# EAGLE design dualevse (EAGLE 9.5.0)
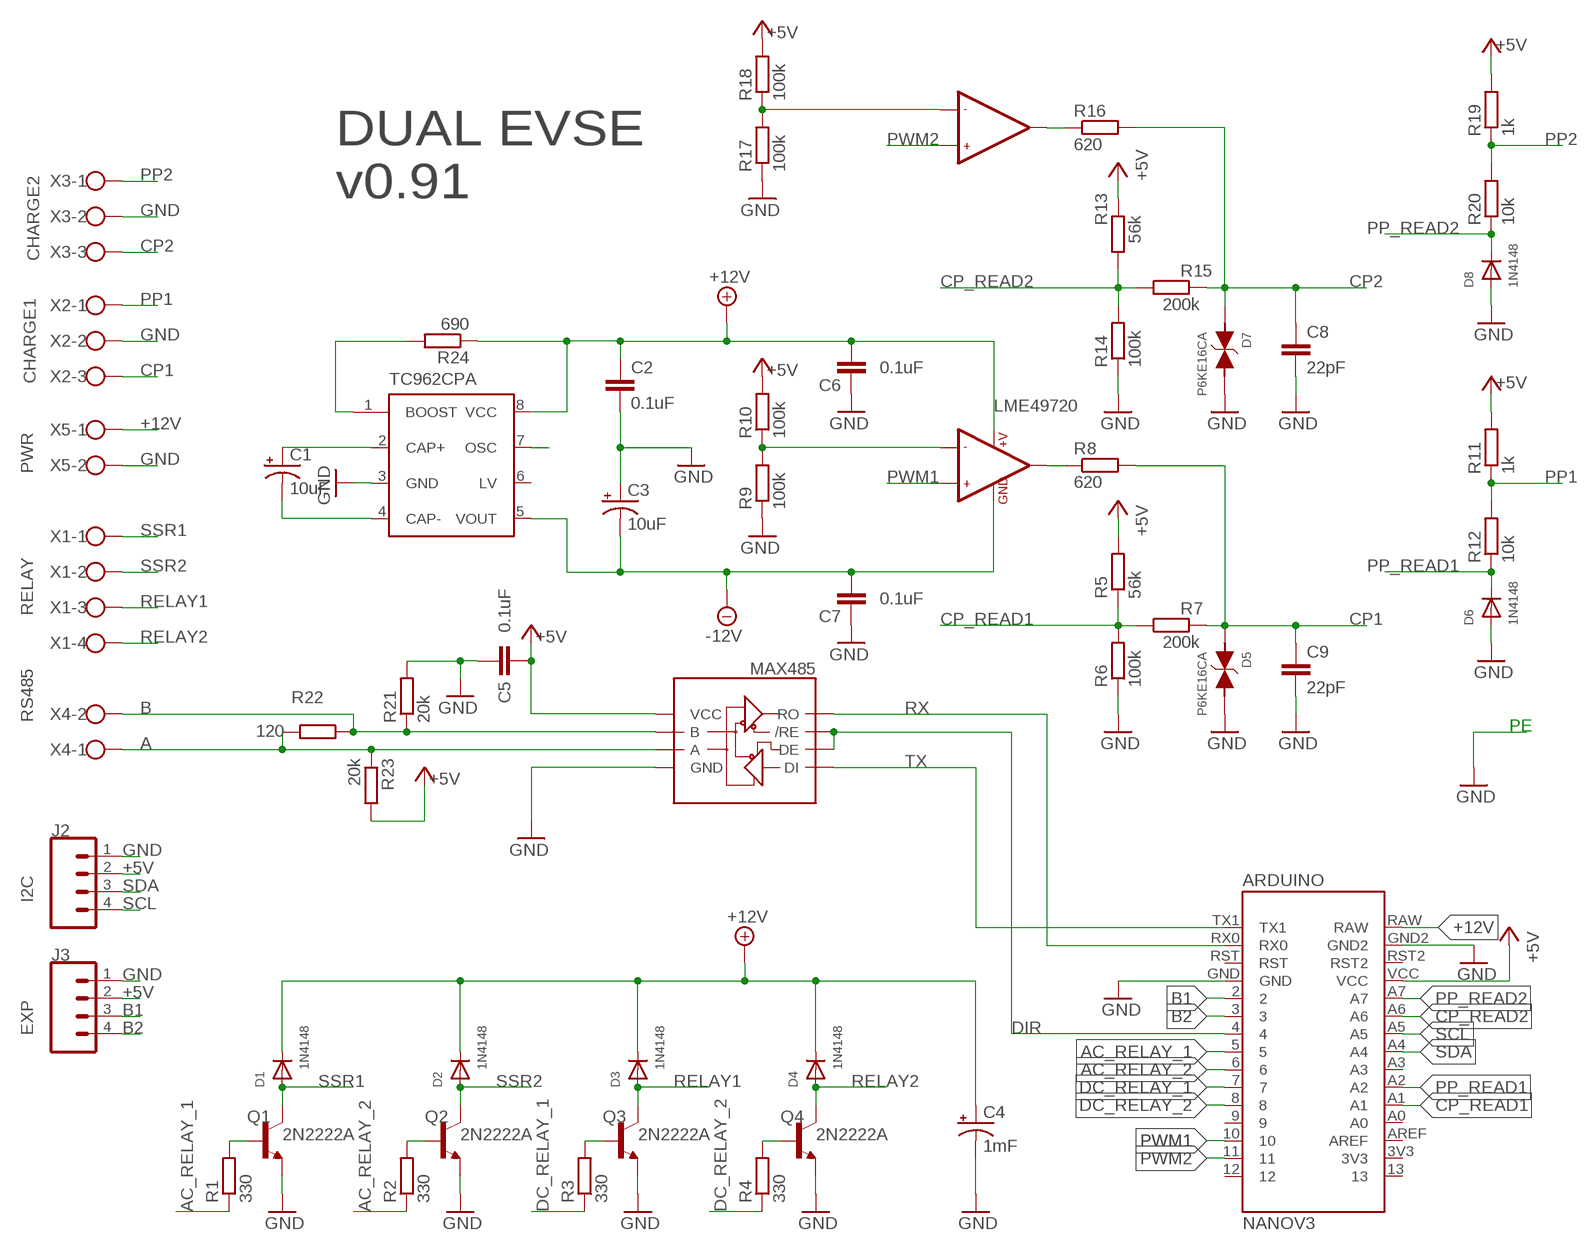
[diagram p0: schematic, sheet 1]

## Parts
ARDUINO  NANOV3  [NANOV3]
C1  10uF  10UF-POLAR-RADIAL-2.5MM-25V-20%  [CPOL-RADIAL-2.5MM-5MM]
C2  0.1uF  0.1UF-KIT-EZ-50V-20%  [CAP-PTH-SMALL-KIT]
C3  10uF  10UF-POLAR-RADIAL-2.5MM-25V-20%  [CPOL-RADIAL-2.5MM-5MM]
C4  1mF  1000UF-RADIAL-5MM-25V-20%  [CPOL-RADIAL-5MM-10MM]
C5  0.1uF  0.1UF-KIT-EZ-50V-20%  [CAP-PTH-SMALL-KIT]
C6  0.1uF  0.1UF-KIT-EZ-50V-20%  [CAP-PTH-SMALL-KIT]
C7  0.1uF  0.1UF-KIT-EZ-50V-20%  [CAP-PTH-SMALL-KIT]
C8  22pF  22PF-PTH-2.54MM-200V-5%  [CAP-PTH-2.54]
C9  22pF  22PF-PTH-2.54MM-200V-5%  [CAP-PTH-2.54]
D1  1N4148  DIODEDO-1N4148  [DO-1N4148]
D2  1N4148  DIODEDO-1N4148  [DO-1N4148]
D3  1N4148  DIODEDO-1N4148  [DO-1N4148]
D4  1N4148  DIODEDO-1N4148  [DO-1N4148]
D5  P6KE16CA  TVSDO2  [C4111-15]
D6  1N4148  DIODEDO-1N4148  [DO-1N4148]
D7  P6KE16CA  TVSDO2  [C4111-15]
D8  1N4148  DIODEDO-1N4148  [DO-1N4148]
J2  I2C  CONN_04POLAR  [MOLEX-1X4]
J3  EXP  CONN_04POLAR  [MOLEX-1X4]
LME49720  LME49720  LF353DIL08  [TEXAS_DIL08]
MAX485  SPARKFUN-IC-COMMS_RS485  [TEXAS_DIL08]
Q1  2N2222A  [TO18]
Q2  2N2222A  [TO18]
Q3  2N2222A  [TO18]
Q4  2N2222A  [TO18]
R1  330  R-EU_0207/10  [0207/10]
R2  330  R-EU_0207/10  [0207/10]
R3  330  R-EU_0207/10  [0207/10]
R4  330  R-EU_0207/10  [0207/10]
R5  56k  R-EU_0207/10  [0207/10]
R6  100k  R-EU_0207/10  [0207/10]
R7  200k  R-EU_0207/10  [0207/10]
R8  620  R-EU_0207/10  [0207/10]
R9  100k  R-EU_0207/10  [0207/10]
R10  100k  R-EU_0207/10  [0207/10]
R11  1k  R-EU_0207/10  [0207/10]
R12  10k  R-EU_0207/10  [0207/10]
R13  56k  R-EU_0207/10  [0207/10]
R14  100k  R-EU_0207/10  [0207/10]
R15  200k  R-EU_0207/10  [0207/10]
R16  620  R-EU_0207/10  [0207/10]
R17  100k  R-EU_0207/10  [0207/10]
R18  100k  R-EU_0207/10  [0207/10]
R19  1k  R-EU_0207/10  [0207/10]
R20  10k  R-EU_0207/10  [0207/10]
R21  20k  R-EU_0207/10  [0207/10]
R22  120  R-EU_0207/10  [0207/10]
R23  20k  R-EU_0207/10  [0207/10]
R24  690  R-EU_0207/10  [0207/10]
TC962CPA  TEXAS_TL7660  [TEXAS_DIL08]
X1  RELAY  W237-4  [W237-4]
X2  CHARGE1  W237-103  [W237-103]
X3  CHARGE2  W237-103  [W237-103]
X4  RS485  W237-102  [W237-102]
X5  PWR  W237-102  [W237-102]

## Nets
+5V [PWR]: ARDUINO.VCC C5.2 J2.2 J3.2 MAX485.8(VCC) R5.2 R10.2 R11.2 R13.2 R18.2 R19.2 R23.2
+12V [PWR]: ARDUINO.RAW C2.1 C4.+ C6.1 D1.C D2.C D3.C D4.C LME49720.8(+V) R24.1 TC962CPA.8(VCC) X5.1
-12V [PWR]: C3.2(-) C7.2 LME49720.4(GND) TC962CPA.5(VOUT)
A: MAX485.6(A) R22.1 R23.1 X4.1
AC_RELAY_1: ARDUINO.5 R1.1
AC_RELAY_2: ARDUINO.6 R2.1
B: MAX485.7(B) R21.1 R22.2 X4.2
B1: ARDUINO.2 J3.3
B2: ARDUINO.3 J3.4
CP1 [PWR]: C9.1 D5.A R7.2 R8.2 X2.3
CP2 [PWR]: C8.1 D7.A R15.2 R16.2 X3.3
CP_READ1: ARDUINO.A1 R5.1 R6.2 R7.1
CP_READ2: ARDUINO.A6 R13.1 R14.2 R15.1
DC_RELAY_1: ARDUINO.7 R3.1
DC_RELAY_2: ARDUINO.8 R4.1
DIR: ARDUINO.4 MAX485.2(/RE) MAX485.3(DE)
GND [GND]: ARDUINO.GND ARDUINO.GND2 C2.2 C3.1(+) C4.- C5.1 C6.2 C7.1 C8.2 C9.2 D5.C D6.A D7.C D8.A J2.1 J3.1 MAX485.5(GND) Q1.1(E) Q2.1(E) Q3.1(E) Q4.1(E) R6.1 R9.1 R14.1 R17.1 R21.2 TC962CPA.3(GND) X2.2 X3.2 X5.2
N$1: LME49720.6(-IN2) R17.2 R18.1
N$2: Q3.2(B) R3.2
N$3: Q4.2(B) R4.2
N$4: LME49720.7(OUT2) R16.1
N$5: Q1.2(B) R1.2
N$6: Q2.2(B) R2.2
N$7 [PWR]: R24.2 TC962CPA.1(BOOST)
N$10: LME49720.2(-IN1) R9.2 R10.1
N$11: LME49720.1(OUT1) R8.1
N$36: C1.1(+) TC962CPA.2(CAP+)
N$38: C1.2(-) TC962CPA.4(CAP-)
NC: TC962CPA.7(OSC)
PP1 [PWR]: R11.1 R12.2 X2.1
PP2 [PWR]: R19.1 R20.2 X3.1
PP_READ1: ARDUINO.A2 D6.C R12.1
PP_READ2: ARDUINO.A7 D8.C R20.1
PWM1: ARDUINO.10 LME49720.3(+IN1)
PWM2: ARDUINO.11 LME49720.5(+IN2)
RELAY1 [PWR]: D3.A Q3.3(C) X1.3
RELAY2 [PWR]: D4.A Q4.3(C) X1.4
RX: ARDUINO.RX0 MAX485.1(RO)
SCL: ARDUINO.A5 J2.4
SDA: ARDUINO.A4 J2.3
SSR1 [PWR]: D1.A Q1.3(C) X1.1
SSR2 [PWR]: D2.A Q2.3(C) X1.2
TX: ARDUINO.TX1 MAX485.4(DI)
Unconnected: ARDUINO.3V3 ARDUINO.9 ARDUINO.12 ARDUINO.13 ARDUINO.A0 ARDUINO.A3 ARDUINO.AREF ARDUINO.RST ARDUINO.RST2 TC962CPA.6(LV)

## Notes on the sheet
- DUAL EVSE
  v0.91
- PE

## Library data of the parts
ARDUINO = Arduino Nano by Jazz:NANOV3
C1 C3 = SparkFun-Capacitors:10UF-POLAR: 10.0µF polarized capacitors A capacitor is a passive two-terminal electrical component used to store electrical energy temporarily in an electric field.; PROD_ID: CAP-08440
C2 C5-C7 = SparkFun-Capacitors:0.1UF: 0.1µF ceramic capacitors A capacitor is a passive two-terminal electrical component used to store electrical energy temporarily in an electric field.; PROD_ID: CAP-08370
C4 = SparkFun-Capacitors:1000UF: 1,000µF/1mF ceramic capacitors A capacitor is a passive two-terminal electrical component used to store electrical energy temporarily in an electric field. CAP-08070; PROD_ID: CAP-09538
C8 C9 = SparkFun-Capacitors:22PF: 22pF ceramic capacitors A capacitor is a passive two-terminal electrical component used to store electrical energy temporarily in an electric field.; PROD_ID: CAP-09128
D1-D4 D6 D8 = adafruit:DIODE: Diode SMADIODE - SMA Surface Mount Package 20V 1A Schottky Diode Digikey: 641-1014-6-ND DO-1N4148 - Through Hole Small Current Diode SOD-123 20V 1 A (.5mV Vf) Schottky Diode - Digikey: MBRX120TPMSCT-ND SOD-323 10V 570mA (.38mV Vf, 3ns) Schottky Diode - Digikey: ZLLS410CT-ND SOD-523 30V 30mA Schottky Diode (RB751S-40TE61) - Digikey: RB751S-40TE61CT-ND SOT23-R/W - SOT23 Package (R = Solder Paste/Reflow Ovens, W = Hand-Soldering) BAT54Film 40V 300mA - Digikey: 497-7162-1-ND
D5 D7 = evse_nano:TVS: WE-TVSP Power TVS Diode <http://katalog.we-online.de/media/images/v2/WE-TVSP_600W-3000W_D0214AA_4C.jpg> Details see: http://katalog.we-online.de/en/pbs/WE-TVSP/824500101 2015 (C) Würth Elektronik
J2 J3 = SparkFun-Connectors:CONN_04: Multi connection point. Often used as Generic Header-pin footprint for 0.1 inch spaced/style header connections On any of the 0.1 inch spaced packages, you can populate with these: Break Away Headers - Straight <https://www.sparkfun.com/products/116> (PRT-00116) Break Away Male Headers - Right Angle <https://www.sparkfun.com/products/553> (PRT-00553) Female Headers <https://www.sparkfun.com/products/115> (PRT-00115) Break Away Headers - Machine Pin <https://www.sparkfun.com/products/117> (PRT-00117) Break Away Female Headers - Swiss Machine Pin <https://www.sparkfun.com/products/743> (PRT-00743) For SCREWTERMINALS and SPRING TERMINALS visit here: Screw Terimnals on SparkFun.com <https://www.sparkfun.com/search/results?term=Screw+Terminals> (5mm/3.5mm/2.54mm spacing) This device is also useful as a general connection point to wire up your design to another part of your project. Our various solder wires solder well into these plated through hole pads. Hook-Up Wire - Assortment (Stranded, 22 AWG) <https://www.sparkfun.com/products/11375> (PRT-11375) Hook-Up Wire - Assortment (Solid Core, 22 AWG) <https://www.sparkfun.com/products/11367> (PRT-11367) View the entire wire category on our website here <https://www.sparkfun.com/categories/141> Special notes: Molex polarized connector foot print use with SKU : PRT-08231 with associated crimp pins and housings. 1MM SMD Version SKU: PRT-10208; PROD_ID: CONN-08186; SF_ID: PRT-08231
LME49720 = evse_nano:LF353
MAX485 = evse_nano:SPARKFUN-IC-COMMS_RS485: RS-485 Transceiver SP3485 Series 8 Pin NSOIC 3.3 V Low Power Half Duplex RS-485 Transceiver MAX3485 compatible Datasheet <http://www.sparkfun.com/datasheets/Components/General/sp3485CN-LTR.pdf> SparkFun Products SparkFun Transceiver Breakout - RS-485 <https://www.sparkfun.com/products/10124> (BOB-10124) SparkFun USB to RS-485 Converter <https://www.sparkfun.com/products/9822> (BOB-09822)
Q1-Q4 = transistor-npn:2N2222*: NPN Transistor
R1-R24 = resistor:R-EU_: RESISTOR, European symbol
TC962CPA = evse_nano:TEXAS_TL7660: CMOS VOLTAGE CONVERTER Source: http://focus.ti.com/lit/ds/scas794/scas794.pdf
X1 = con-wago-500:W237-4: WAGO SCREW CLAMP; OC_FARNELL: unknown; OC_NEWARK: unknown
X2 X3 = con-wago-500:W237-103: WAGO SCREW CLAMP; MPN: 237-103; OC_FARNELL: unknown; OC_NEWARK: 18M7116
X4 X5 = con-wago-500:W237-102: WAGO SCREW CLAMP; MPN: 237-102; OC_FARNELL: unknown; OC_NEWARK: 70K9898

## Net classes
0 default: width 0.508 mm, drill 0.254 mm, clearance 0.254 mm
1 GND: width 1.016 mm, drill 0.508 mm, clearance 0.254 mm
4 PWR: width 1.016 mm, drill 0.508 mm, clearance 0.254 mm to class 2, clearance 0.254 mm

## Board
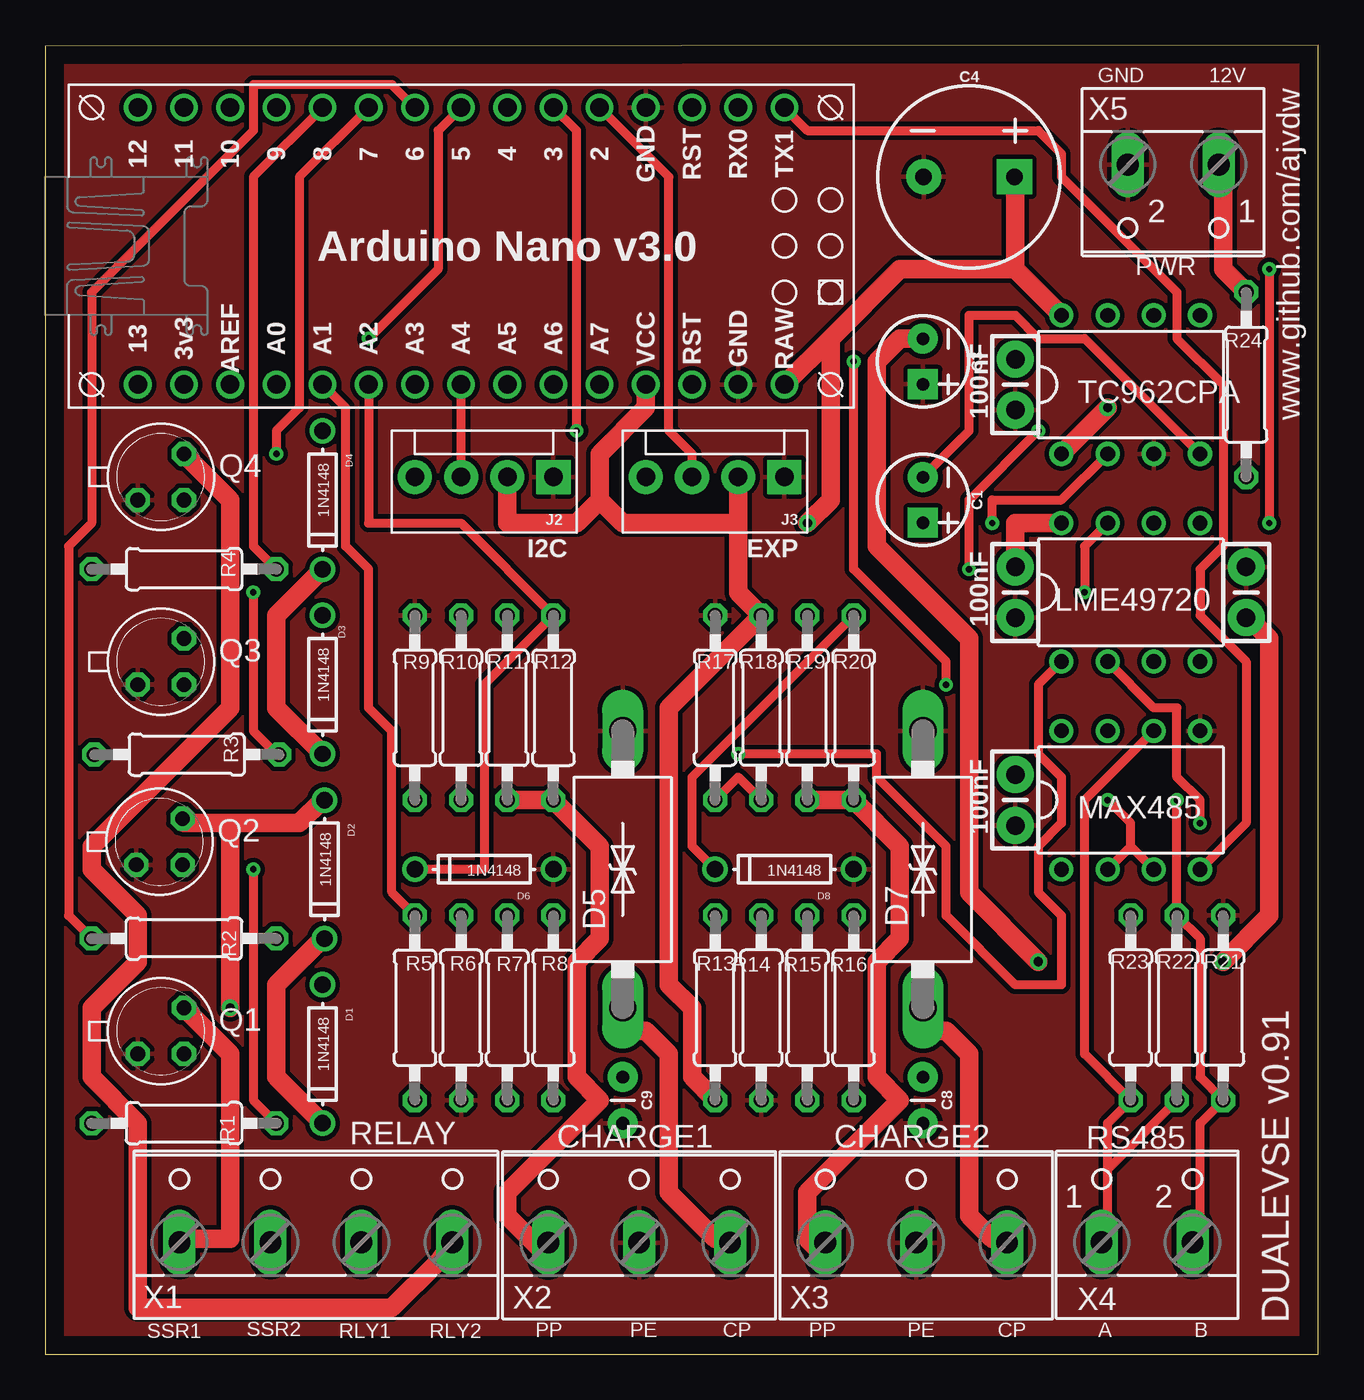
[diagram p1: board, top side]
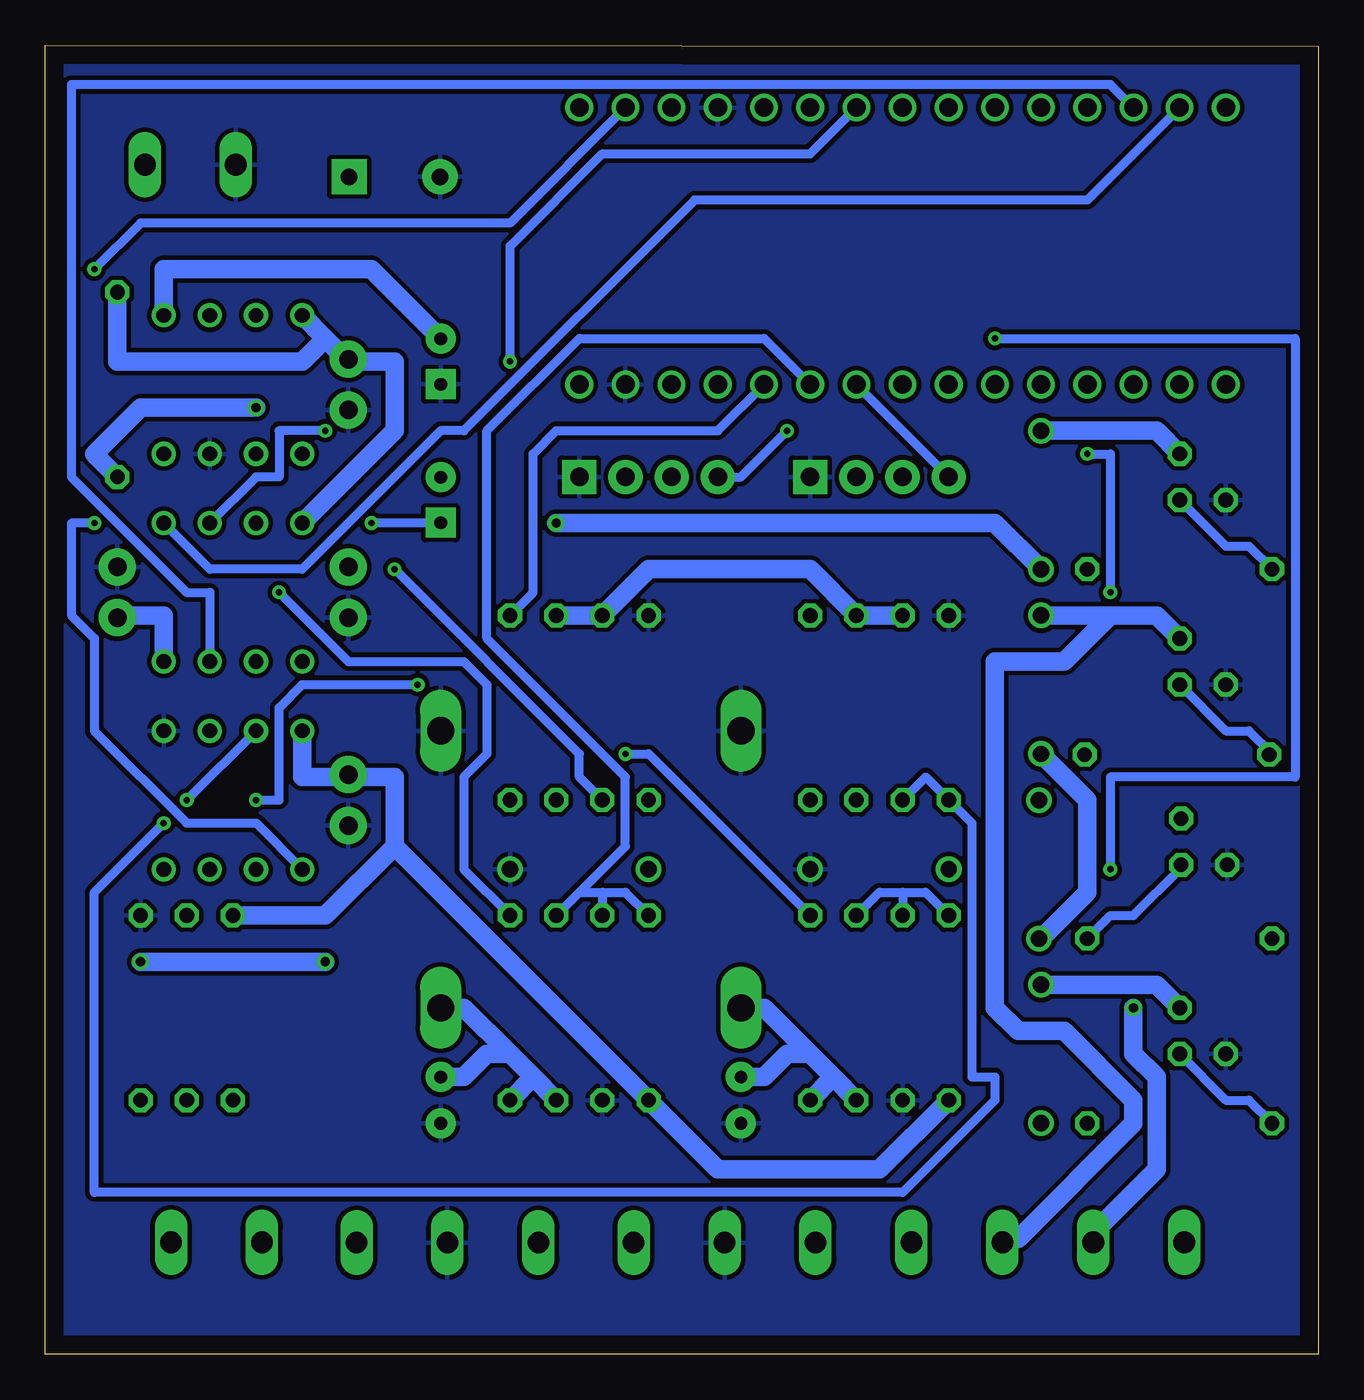
[diagram p2: board, bottom side, seen from below]

Size 70 x 72 mm. Coordinates in mm from the lower left corner, seen from the top.
Outline: 0,0 70,0 70,72 0,71.97 0,0
Copper layers (1*16): Top 0.035mm / dielectric 1.5mm / Bottom 0.035mm
Design rules "default": minimum track width 6mil, minimum drill 0.35mm, track to track 6mil, track to pad 6mil, pad to pad 6mil, via to via 6mil, smd to smd 6mil, copper to edge 40mil, drill to drill 6mil, minimum pad ring 10mil, minimum via ring 8mil, stop-mask expansion 4mil, vias tented up to drill 0mil, thermal gap 10mil

### Footprints (pad centres in the part's own frame; a part is rotated, then mirrored left to right if it is on the bottom)
NANOV3 = drill 1.016: 2 -7.62,5.08; 3 -7.62,2.54; 3V3 7.62,-17.78; 4 -7.62,0; 5 -7.62,-2.54; 6 -7.62,-5.08; 7 -7.62,-7.62; 8 -7.62,-10.16; 9 -7.62,-12.7; 10 -7.62,-15.24; 11 -7.62,-17.78; 12 -7.62,-20.32; 13 7.62,-20.32; A0 7.62,-12.7; A1 7.62,-10.16; A2 7.62,-7.62; A3 7.62,-5.08; A4 7.62,-2.54; A5 7.62,0; A6 7.62,2.54; A7 7.62,5.08; AREF 7.62,-15.24; GND -7.62,7.62; GND2 7.62,12.7; RAW 7.62,15.24; RST -7.62,10.16; RST2 7.62,10.16; RX0 -7.62,12.7; TX1 -7.62,15.24; VCC 7.62,7.62
CPOL-RADIAL-2.5MM-5MM = drill 0.7 pad 1.651 square: 1 1.25,0 | drill 0.7 pad 1.651: 2 -1.25,0
CAP-PTH-SMALL-KIT = drill 1.016 pad 2.032: 1 -1.397,0; 2 1.397,0
CPOL-RADIAL-5MM-10MM = drill 0.9 pad 1.93 square: + 2.5,0 | drill 0.9 pad 1.93: - -2.5,0
CAP-PTH-2.54 = drill 0.7 pad 1.651: 1 -1.27,0; 2 1.27,0
DO-1N4148 = drill 0.9: A -3.81,0; C 3.81,0
C4111-15 = drill 1.499 long: A 7.62,0; C -7.62,0
MOLEX-1X4 = drill 1.016 pad 1.88 square: 1 0,0 | drill 1.016 pad 1.88: 2 2.54,0; 3 5.08,0; 4 7.62,0
TEXAS_DIL08 = drill 0.813 pad 1.27: 1 -3.81,-3.81; 2 -1.27,-3.81; 3 1.27,-3.81; 4 3.81,-3.81; 5 3.81,3.81; 6 1.27,3.81; 7 -1.27,3.81; 8 -3.81,3.81
TO18 = drill 0.813 octagon: 1 -1.27,-1.27; 2 1.27,-1.27; 3 1.27,1.27
0207/10 = drill 0.813 octagon: 1 -5.08,0; 2 5.08,0
W237-4 = drill 1.194 long: 1 -7.5,-1.27; 2 -2.5,-1.27; 3 2.5,-1.27; 4 7.5,-1.27
W237-103 = drill 1.194 long: 1 -5,-1.29; 2 0,-1.29; 3 5,-1.29
W237-102 = drill 1.194 long: 1 -2.5,-1.27; 2 2.5,-1.27

### Placement (x,y rotation side)
ARDUINO  25.4,60.96 270 top
C1  48.26,46.99 270 top
C2  53.34,53.34 270 top
C3  48.26,54.61 270 top
C4  50.8,64.77 0 top
C5  53.34,30.48 90 top
C6  53.34,41.91 270 top
C7  66.04,41.91 270 top
C8  48.26,13.97 270 top
C9  31.75,13.97 270 top
D1  15.24,16.51 270 top
D2  15.35,26.67 270 top
D3  15.24,36.83 270 top
D4  15.24,46.99 270 top
D5  31.75,26.67 270 top
D6  24.13,26.67 180 top
D7  48.26,26.67 270 top
D8  40.64,26.67 180 top
J2  27.94,48.26 180 top
J3  40.64,48.26 180 top
LME49720  59.69,41.91 0 top
MAX485  59.69,30.48 0 top
Q1  6.35,17.78 0 top
Q2  6.27,28.19 0 top
Q3  6.35,38.1 0 top
Q4  6.35,48.26 0 top
R1  7.62,12.7 180 top
R2  7.62,22.86 0 top
R3  7.77,32.98 180 top
R4  7.62,43.18 180 top
R5  20.32,19.05 270 top
R6  22.86,19.05 90 top
R7  25.4,19.05 270 top
R8  27.94,19.05 270 top
R9  20.32,35.56 270 top
R10  22.86,35.56 90 top
R11  25.4,35.56 90 top
R12  27.94,35.56 270 top
R13  36.83,19.05 270 top
R14  39.37,19.05 90 top
R15  41.91,19.05 270 top
R16  44.45,19.05 270 top
R17  36.83,35.56 270 top
R18  39.37,35.56 90 top
R19  41.91,35.56 90 top
R20  44.45,35.56 270 top
R21  64.77,19.05 90 top
R22  62.23,19.05 90 top
R23  59.69,19.05 90 top
R24  66.04,53.34 270 top
TC962CPA  59.69,53.34 0 top
X1  14.87,7.42 0 top
X2  32.65,7.42 0 top
X3  47.89,7.42 0 top
X4  60.59,7.42 0 top
X5  62.03,64.17 180 top

### Tracks (layer width: path | path; a pad name or v marks a point on that pad's centre or on a via)
+5V
  Top 1.016: ARDUINO.VCC 33.02,52.07 30.48,49.53 30.48,46.99 | 30.48,46.99 29.21,45.72 25.4,45.72 J2.2 | 38.1,45.72 38.1,41.91 R18.2 34.29,35.56 34.29,20.32 35.56,19.05 35.56,15.24 R13.2 | 38.1,45.72 J3.2 | 30.48,46.99 31.75,45.72 38.1,45.72
  Bottom 1.016: R10.2 R11.2 27.94,43.18 36.83,43.18 R18.2 R19.2 | R23.2 54.61,24.13 50.8,27.94 | 50.8,27.94 50.8,31.75 53.34,31.75 | MAX485.8 55.88,31.75 53.34,31.75 | 53.34,31.75 C5.2 | R5.2 24.13,10.16 33.02,10.16 R13.2 50.8,27.94
+12V  (via drill 0.51)
  Top 1.016: D1.C 12.7,15.24 12.7,20.32 15.24,22.86 D2.C | D4.C 12.7,40.64 12.7,35.56 D3.C | R24.1 64.77,59.69 64.77,64.77 X5.1 | LME49720.8 53.34,45.72 C6.1 53.34,43.18 | 53.34,59.69 TC962CPA.8 | 53.34,59.69 53.34,64.77 C4.+ | 43.18,55.88 46.99,59.69 53.34,59.69 | 43.18,55.88 ARDUINO.RAW | v41.91,45.72 43.18,46.99 43.18,55.88
  Bottom 1.016: D3.C 12.7,30.48 12.7,25.4 15.24,22.86 D2.C | TC962CPA.8 54.61,55.88 | 54.61,55.88 53.34,54.61 | LME49720.8 50.8,50.8 50.8,54.61 53.34,54.61 | 53.34,54.61 C2.1 | R24.1 66.04,54.61 55.88,54.61 54.61,55.88 | D4.C 17.78,45.72 v41.91,45.72
-12V  (via drill 0.51)
  Top 1.016: v64.77,21.59 67.31,24.13 67.31,39.37 66.04,40.64 C7.2 | v54.61,21.59 50.8,25.4 50.8,39.37 45.72,44.45 45.72,54.61 46.99,55.88 48.26,55.88 C3.2
  Bottom 1.016: LME49720.4 63.5,40.64 66.04,40.64 C7.2 | TC962CPA.5 63.5,59.69 52.07,59.69 48.26,55.88 C3.2 | v54.61,21.59 v64.77,21.59
A
  Top 0.508: 58.42,10.16 58.42,6.35 X4.1 | 58.42,10.16 58.42,12.7 R23.1 57.15,16.51 57.15,30.48 MAX485.6 | 58.42,10.16 R22.1
AC_RELAY_1  (via drill 0.35)
  Top 0.508: R1.1 11.43,13.97 v11.43,26.67 | v17.78,55.88 21.59,59.69 21.59,67.31 ARDUINO.5
  Bottom 0.508: v11.43,26.67 11.43,31.75 1.27,31.75 1.27,55.88 v17.78,55.88
AC_RELAY_2
  Top 0.508: R2.1 1.27,24.13 1.27,44.45 2.54,45.72 2.54,58.42 11.43,67.31 11.43,69.85 19.05,69.85 ARDUINO.6
B  (via drill 0.35)
  Top 0.508: X4.2 63.5,6.35 63.5,12.7 R21.1 63.5,15.24 63.5,22.86 R22.2 v62.23,30.48
  Bottom 0.508: v62.23,30.48 MAX485.7
B1
  Top 0.508: ARDUINO.2 34.29,64.77 34.29,50.8 35.56,49.53 J3.3
B2  (via drill 0.35)
  Top 0.508: ARDUINO.3 29.21,67.31 v29.21,50.8
  Bottom 0.508: v29.21,50.8 31.75,48.26 J3.4
CP1
  Top 1.016: D5.A 31.75,17.78 33.02,17.78 34.29,16.51 34.29,8.89 36.83,6.35 X2.3
  Bottom 1.016: 27.94,16.51 30.48,19.05 D5.A | 27.94,16.51 26.67,15.24 | 26.67,15.24 R7.2 | 26.67,15.24 R8.2 | C9.1 30.48,15.24 29.21,16.51 27.94,16.51
CP2
  Top 1.016: D7.A 48.26,17.78 49.53,17.78 50.8,16.51 50.8,7.62 52.07,6.35 X3.3
  Bottom 1.016: 44.45,16.51 46.99,19.05 D7.A | 44.45,16.51 43.18,15.24 | 43.18,15.24 R15.2 | 43.18,15.24 R16.2 | C8.1 46.99,15.24 45.72,16.51 44.45,16.51
CP_READ1
  Top 0.508: ARDUINO.A1 16.51,52.07 16.51,44.45 17.78,43.18 17.78,35.56 19.05,34.29 19.05,25.4 R5.1
  Bottom 0.508: R5.1 21.59,25.4 22.86,25.4 | 22.86,25.4 24.13,25.4 R7.1 | 22.86,25.4 R6.2
CP_READ2
  Bottom 0.508: R13.1 38.1,25.4 39.37,25.4 | 40.64,25.4 39.37,25.4 | R15.1 40.64,25.4 | 39.37,25.4 R14.2 | ARDUINO.A6 30.48,55.88 40.64,55.88 45.72,50.8 45.72,39.37 38.1,31.75 38.1,27.94 40.64,25.4
DC_RELAY_1  (via drill 0.35)
  Top 0.508: v11.43,41.91 11.43,34.29 12.7,33.02 R3.1 | v12.7,49.53 12.7,50.8 13.97,52.07 13.97,64.77 ARDUINO.7
  Bottom 0.508: v11.43,41.91 11.43,49.53 v12.7,49.53
DC_RELAY_2
  Top 0.508: R4.1 11.43,44.45 11.43,64.77 ARDUINO.8
DIR  (via drill 0.35)
  Top 0.508: 59.69,27.94 MAX485.2 | MAX485.3 59.69,27.94 | v44.45,54.61 44.45,43.18 49.53,38.1 v49.53,36.83 | v58.42,30.48 59.69,29.21 59.69,27.94
  Bottom 0.508: ARDUINO.4 27.94,66.04 39.37,66.04 44.45,60.96 v44.45,54.61 | v49.53,36.83 55.88,36.83 57.15,35.56 57.15,30.48 v58.42,30.48
GND
  pour Top: -5.08,-3.81 -5.08,77.47 74.93,77.47 74.93,-3.86
  pour Bottom: -2.87,73.29 72.7,73.35 72.7,-1.44 -1.9,-1.44
N$1  (via drill 0.35)
  Top 0.508: R17.2 38.1,31.75 R18.1 | v54.61,50.8 50.8,46.99 v50.8,43.18
  Bottom 0.508: LME49720.6 58.42,48.26 57.15,48.26 57.15,50.8 v54.61,50.8 | v50.8,43.18 40.64,33.02 40.64,31.75 R18.1
N$2
  Bottom 0.508: Q3.2 5.08,34.29 3.81,34.29 2.54,33.02 R3.2
N$3
  Bottom 0.508: R4.2 3.81,44.45 5.08,44.45 Q4.2
N$4  (via drill 0.35)
  Top 0.508: v57.15,41.91 57.15,44.45 LME49720.7
  Bottom 0.508: R16.1 46.99,26.67 46.99,31.75 45.72,33.02 45.72,36.83 46.99,38.1 53.34,38.1 v57.15,41.91
N$5
  Bottom 0.508: R1.2 3.81,13.97 5.08,13.97 Q1.2
N$6
  Bottom 0.508: R2.2 11.43,24.13 10.16,24.13 7.62,26.67 Q2.2
N$7  (via drill 0.51)
  Top 1.016: v58.42,52.07 TC962CPA.1
  Bottom 1.016: v58.42,52.07 64.77,52.07 67.31,49.53 R24.2
N$10  (via drill 0.35)
  Top 0.508: LME49720.2 60.96,35.56 62.23,35.56 62.23,31.75 63.5,30.48 v63.5,29.21
  Bottom 0.508: R10.1 21.59,31.75 R9.2 19.05,29.21 19.05,15.24 17.78,15.24 17.78,13.97 22.86,8.89 67.31,8.89 67.31,25.4 v63.5,29.21
N$11  (via drill 0.35)
  Top 0.508: v38.1,33.02 45.72,33.02 45.72,31.75 49.53,27.94 49.53,24.13 53.34,20.32 55.88,20.32 55.88,24.13 54.61,25.4 54.61,27.94 55.88,29.21 55.88,31.75 54.61,33.02 54.61,36.83 LME49720.1
  Bottom 0.508: R8.1 36.83,33.02 v38.1,33.02
N$36  (via drill 0.35)
  Top 0.508: TC962CPA.2 55.88,46.99 52.07,46.99 v52.07,45.72
  Bottom 0.508: v52.07,45.72 48.26,45.72 C1.1
N$38
  Top 0.508: TC962CPA.4 57.15,55.88 54.61,55.88 53.34,57.15 50.8,57.15 50.8,50.8 48.26,48.26 C1.2
PP1
  Top 1.016: R11.1 R12.2 30.48,27.94 30.48,22.86 29.21,21.59 29.21,15.24 30.48,13.97 25.4,8.89 25.4,7.62 27.94,5.08 X2.1
PP2
  Top 1.016: R19.1 R20.2 46.99,27.94 46.99,22.86 45.72,21.59 45.72,15.24 46.99,13.97 41.91,8.89 41.91,6.35 43.18,5.08 X3.1
PP_READ1
  Top 0.508: ARDUINO.A2 17.78,45.72 22.86,45.72 R12.1 24.13,36.83 24.13,26.67 D6.C
PP_READ2
  Top 0.508: R20.1 35.56,31.75 35.56,27.94 D8.C
  Bottom 0.508: ARDUINO.A7 33.02,50.8 41.91,50.8 43.18,49.53 43.18,41.91 R20.1
PWM1
  Bottom 0.508: LME49720.3 60.96,41.91 62.23,41.91 68.58,48.26 68.58,69.85 11.43,69.85 ARDUINO.10
PWM2
  Bottom 0.508: LME49720.5 60.96,43.18 55.88,43.18 48.26,50.8 46.99,50.8 34.29,63.5 12.7,63.5 ARDUINO.11
RELAY1
  Bottom 1.016: Q3.3 8.89,40.64 11.43,40.64 | D3.A 11.43,40.64 | 11.43,40.64 13.97,38.1 17.78,38.1 17.78,19.05 16.51,17.78 13.97,17.78 10.16,13.97 10.16,12.7 16.51,6.35 X1.3
RELAY2
  Top 1.016: Q4.3 10.16,46.99 10.16,35.56 2.54,27.94 2.54,26.67 5.08,24.13 5.08,21.59 2.54,19.05 2.54,15.24 5.08,12.7 5.08,2.54 19.05,2.54 21.59,5.08 X1.4
  Bottom 1.016: Q4.3 8.89,50.8 D4.A
RX  (via drill 0.35)
  Top 0.508: v67.31,59.69 v67.31,45.72
  Bottom 0.508: MAX485.1 58.42,29.21 62.23,29.21 67.31,34.29 67.31,39.37 68.58,40.64 68.58,45.72 v67.31,45.72 | v67.31,59.69 64.77,62.23 44.45,62.23 ARDUINO.RX0
SCL
  Bottom 0.508: J2.4 ARDUINO.A5
SDA
  Top 0.508: J2.3 ARDUINO.A4
SSR1
  Top 1.016: Q1.3 10.16,16.51 10.16,6.35 7.62,6.35 X1.1
  Bottom 1.016: Q1.3 8.89,20.32 D1.A
SSR2  (via drill 0.51)
  Top 1.016: 10.16,29.21 13.97,29.21 15.24,30.48 D2.A | 10.16,29.21 7.62,29.21 Q2.3 | 10.16,29.21 v10.16,19.05
  Bottom 1.016: v10.16,19.05 10.16,16.51 8.89,15.24 8.89,10.16 12.7,6.35 X1.2
TX
  Top 0.508: MAX485.4 66.04,29.21 66.04,38.1 63.5,40.64 63.5,43.18 64.77,44.45 64.77,53.34 62.23,55.88 62.23,58.42 55.88,64.77 55.88,66.04 54.61,67.31 41.91,67.31 ARDUINO.TX1

### Text on the board
tNames: www.github.com/ajvdw | 100nF | 100nF | 100nF | DUALEVSE v0.91